# EAGLE design Connections and Power (EAGLE 8.5.2)
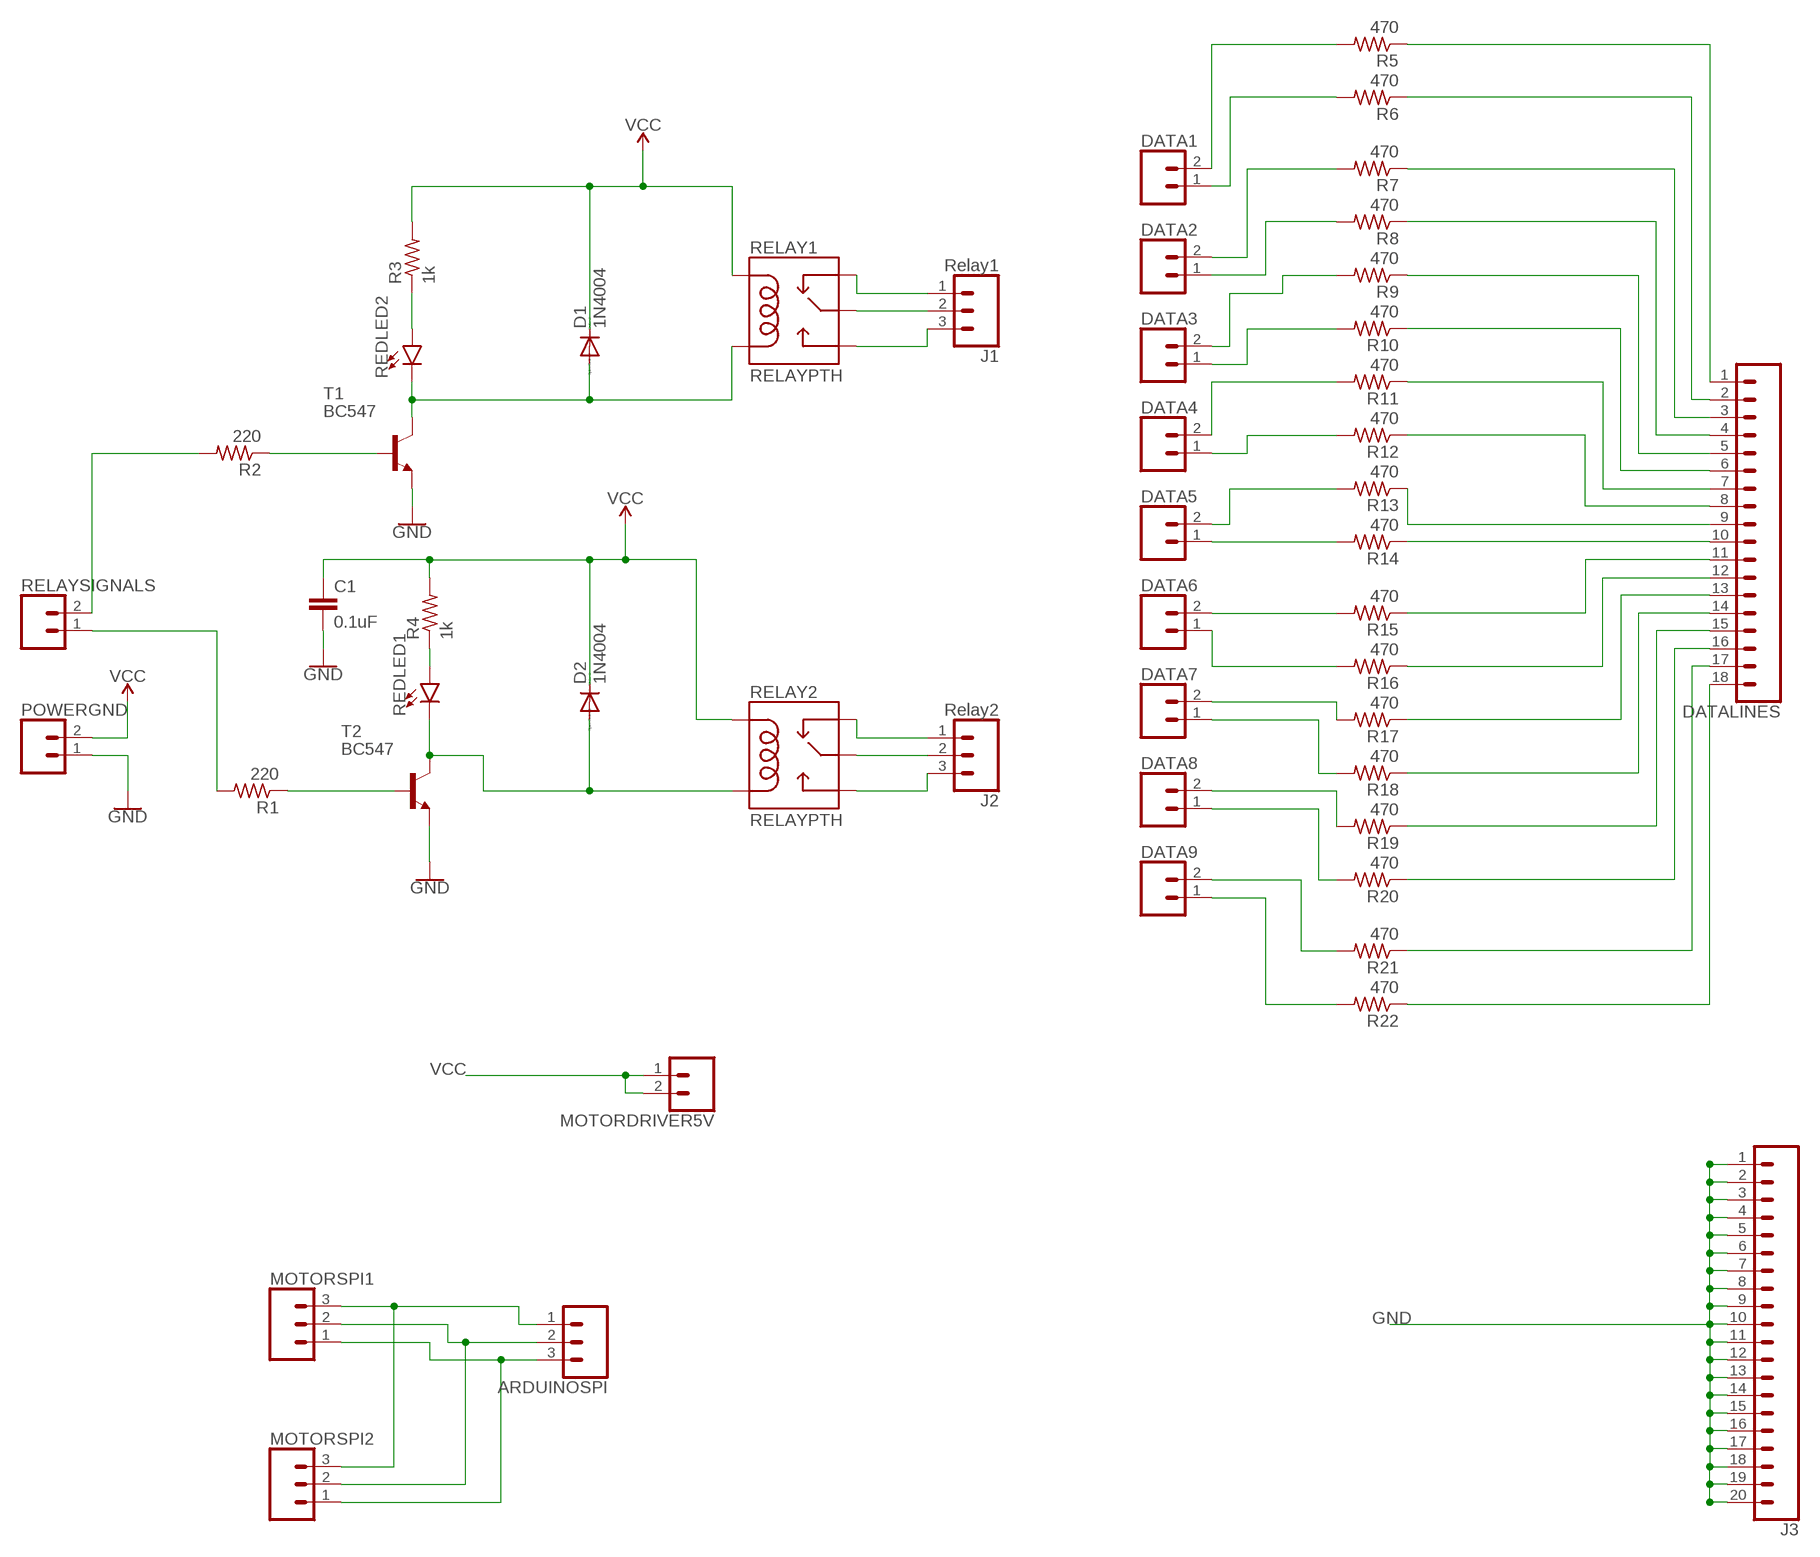
[diagram p0: schematic, sheet 1]

## Parts
ARDUINOSPI  CONN_03  [1X03]
C1  0.1uF  0.1UF-KIT-EZ-50V-20%  [CAP-PTH-SMALL-KIT]
D1  1N4004  [DO41-10]
D2  1N4004  [DO41-10]
DATA1  CONN_023.5MM  [SCREWTERMINAL-3.5MM-2]
DATA2  CONN_023.5MM  [SCREWTERMINAL-3.5MM-2]
DATA3  CONN_023.5MM  [SCREWTERMINAL-3.5MM-2]
DATA4  CONN_023.5MM  [SCREWTERMINAL-3.5MM-2]
DATA5  CONN_023.5MM  [SCREWTERMINAL-3.5MM-2]
DATA6  CONN_023.5MM  [SCREWTERMINAL-3.5MM-2]
DATA7  CONN_023.5MM  [SCREWTERMINAL-3.5MM-2]
DATA8  CONN_023.5MM  [SCREWTERMINAL-3.5MM-2]
DATA9  CONN_023.5MM  [SCREWTERMINAL-3.5MM-2]
DATALINES  CONN_18  [1X18]
J1  Relay1  CONN_03-SCREW-5MM  [SCREWTERMINAL-5MM-3]
J2  Relay2  CONN_03-SCREW-5MM  [SCREWTERMINAL-5MM-3]
J3  CONN_20  [1X20]
MOTORDRIVER5V  CONN_02  [1X02]
MOTORSPI1  CONN_03  [1X03]
MOTORSPI2  CONN_03  [1X03]
POWERGND  CONN_025MM  [SCREWTERMINAL-5MM-2]
R1  220  R-US_0309/12  [0309/12]
R2  220  R-US_0309/12  [0309/12]
R3  1k  R-US_0309/12  [0309/12]
R4  1k  R-US_0309/12  [0309/12]
R5  470  R-US_0309/12  [0309/12]
R6  470  R-US_0309/12  [0309/12]
R7  470  R-US_0309/12  [0309/12]
R8  470  R-US_0309/12  [0309/12]
R9  470  R-US_0309/12  [0309/12]
R10  470  R-US_0309/12  [0309/12]
R11  470  R-US_0309/12  [0309/12]
R12  470  R-US_0309/12  [0309/12]
R13  470  R-US_0309/12  [0309/12]
R14  470  R-US_0309/12  [0309/12]
R15  470  R-US_0309/12  [0309/12]
R16  470  R-US_0309/12  [0309/12]
R17  470  R-US_0309/12  [0309/12]
R18  470  R-US_0309/12  [0309/12]
R19  470  R-US_0309/12  [0309/12]
R20  470  R-US_0309/12  [0309/12]
R21  470  R-US_0309/12  [0309/12]
R22  470  R-US_0309/12  [0309/12]
REDLED1  LED1206  [LED-1206]
REDLED2  LED1206  [LED-1206]
RELAY1  RELAYPTH  [SRD-05VDC-SL-C]
RELAY2  RELAYPTH  [SRD-05VDC-SL-C]
RELAYSIGNALS  CONN_025MM  [SCREWTERMINAL-5MM-2]
T1  BC547  [TO92]
T2  BC547  [TO92]

## Nets
GND: C1.2 J3.1 J3.2 J3.3 J3.4 J3.5 J3.6 J3.7 J3.8 J3.9 J3.10 J3.11 J3.12 J3.13 J3.14 J3.15 J3.16 J3.17 J3.18 J3.19 J3.20 POWERGND.1 T1.1(E) T2.1(E)
N$1: DATA1.2 R5.2
N$2: D2.A REDLED1.C RELAY2.COIL0 T2.3(C)
N$3: R4.1 REDLED1.A
N$4: R2.2 RELAYSIGNALS.2
N$5: J2.1 RELAY2.SWCLOSED(SWCLOSE)
N$6: J2.2 RELAY2.SWCOMMON
N$7: J2.3 RELAY2.SWOPEN
N$8: R1.1 T2.2(B)
N$9: R2.1 T1.2(B)
N$10: D1.A REDLED2.C RELAY1.COIL0 T1.3(C)
N$11: R3.1 REDLED2.A
N$12: DATA1.1 R6.2
N$13: J1.1 RELAY1.SWCLOSED(SWCLOSE)
N$14: J1.2 RELAY1.SWCOMMON
N$15: J1.3 RELAY1.SWOPEN
N$16: R1.2 RELAYSIGNALS.1
N$17: DATA2.2 R7.2
N$18: DATA2.1 R8.2
N$19: DATA3.2 R9.2
N$20: DATA3.1 R10.2
N$21: DATA4.2 R11.2
N$22: DATA4.1 R12.2
N$23: DATA5.2 R13.2
N$24: DATA5.1 R14.2
N$25: DATA6.2 R15.2
N$26: DATA6.1 R16.2
N$27: DATA7.2 R17.2
N$28: DATA7.1 R18.2
N$29: DATA8.2 R19.2
N$30: DATA8.1 R20.2
N$31: DATA9.2 R21.2
N$32: DATA9.1 R22.2
N$33: DATALINES.18 R22.1
N$34: DATALINES.17 R21.1
N$35: DATALINES.16 R20.1
N$36: DATALINES.15 R19.1
N$37: DATALINES.14 R18.1
N$38: DATALINES.13 R17.1
N$39: DATALINES.12 R16.1
N$40: DATALINES.11 R15.1
N$41: DATALINES.10 R14.1
N$42: DATALINES.1 R5.1
N$43: DATALINES.2 R6.1
N$44: DATALINES.3 R7.1
N$45: DATALINES.4 R8.1
N$46: DATALINES.5 R9.1
N$47: DATALINES.6 R10.1
N$48: DATALINES.7 R11.1
N$49: DATALINES.8 R12.1
N$50: DATALINES.9 R13.1
N$52: ARDUINOSPI.1 MOTORSPI1.3 MOTORSPI2.3
N$54: ARDUINOSPI.2 MOTORSPI1.2 MOTORSPI2.2
N$55: ARDUINOSPI.3 MOTORSPI1.1 MOTORSPI2.1
VCC: C1.1 D1.C D2.C MOTORDRIVER5V.1 MOTORDRIVER5V.2 POWERGND.2 R3.2 R4.2 RELAY1.COIL1 RELAY2.COIL1

## Library data of the parts
ARDUINOSPI MOTORSPI1 MOTORSPI2 = SparkFun-Connectors:CONN_03: Multi connection point. Often used as Generic Header-pin footprint for 0.1 inch spaced/style header connections On any of the 0.1 inch spaced packages, you can populate with these: Break Away Headers - Straight <https://www.sparkfun.com/products/116> (PRT-00116) Break Away Male Headers - Right Angle <https://www.sparkfun.com/products/553> (PRT-00553) Female Headers <https://www.sparkfun.com/products/115> (PRT-00115) Break Away Headers - Machine Pin <https://www.sparkfun.com/products/117> (PRT-00117) Break Away Female Headers - Swiss Machine Pin <https://www.sparkfun.com/products/743> (PRT-00743) Stackable Header - 3 Pin (Female, 0.1") <https://www.sparkfun.com/products/13875> (PRT-13875) For SCREWTERMINALS and SPRING TERMINALS visit here: Screw Terimnals on SparkFun.com <https://www.sparkfun.com/search/results?term=Screw+Terminals> (5mm/3.5mm/2.54mm spacing) This device is also useful as a general connection point to wire up your design to another part of your project. Our various solder wires solder well into these plated through hole pads. Hook-Up Wire - Assortment (Stranded, 22 AWG) <https://www.sparkfun.com/products/11375> (PRT-11375) Hook-Up Wire - Assortment (Solid Core, 22 AWG) <https://www.sparkfun.com/products/11367> (PRT-11367) View the entire wire category on our website here <https://www.sparkfun.com/categories/141> Special notes: Molex polarized connector foot print use with SKU : PRT-08232 with associated crimp pins and housings.; PROD_ID: XXX-00000; VALUE: 455-1750-1-ND
C1 = SparkFun-Capacitors:0.1UF: 0.1µF ceramic capacitors A capacitor is a passive two-terminal electrical component used to store electrical energy temporarily in an electric field.; PROD_ID: CAP-08370
D1 D2 = diode:1N4004: DIODE general purpose rectifier, 1 A
DATA1-DATA9 = SparkFun-Connectors:CONN_02: Multi connection point. Often used as Generic Header-pin footprint for 0.1 inch spaced/style header connections On any of the 0.1 inch spaced packages, you can populate with these: Break Away Headers - Straight <https://www.sparkfun.com/products/116> (PRT-00116) Break Away Male Headers - Right Angle <https://www.sparkfun.com/products/553> (PRT-00553) Female Headers <https://www.sparkfun.com/products/115> (PRT-00115) Break Away Headers - Machine Pin <https://www.sparkfun.com/products/117> (PRT-00117) Break Away Female Headers - Swiss Machine Pin <https://www.sparkfun.com/products/743> (PRT-00743) For SCREWTERMINALS and SPRING TERMINALS visit here: Screw Terimnals on SparkFun.com <https://www.sparkfun.com/search/results?term=Screw+Terminals> (5mm/3.5mm/2.54mm spacing) This device is also useful as a general connection point to wire up your design to another part of your project. Our various solder wires solder well into these plated through hole pads. Hook-Up Wire - Assortment (Stranded, 22 AWG) <https://www.sparkfun.com/products/11375> (PRT-11375) Hook-Up Wire - Assortment (Solid Core, 22 AWG) <https://www.sparkfun.com/products/11367> (PRT-11367) View the entire wire category on our website here <https://www.sparkfun.com/categories/141> Special notes: Molex polarized connector foot print use with: PRT-08233 with associated crimp pins and housings. 2.54_SCREWTERM for use with PRT-10571. 3.5mm Screw Terminal footprints for PRT-08084 5mm Screw Terminal footprints for use with PRT-08432; PROD_ID: CONN-08399
DATALINES = SparkFun-Connectors:CONN_18: Multi connection point. Often used as Generic Header-pin footprint for 0.1 inch spaced/style header connections On any of the 0.1 inch spaced packages, you can populate with these: Break Away Headers - Straight <https://www.sparkfun.com/products/116> (PRT-00116) Break Away Male Headers - Right Angle <https://www.sparkfun.com/products/553> (PRT-00553) Female Headers <https://www.sparkfun.com/products/115> (PRT-00115) Break Away Headers - Machine Pin <https://www.sparkfun.com/products/117> (PRT-00117) Break Away Female Headers - Swiss Machine Pin <https://www.sparkfun.com/products/743> (PRT-00743) For SCREWTERMINALS and SPRING TERMINALS visit here: Screw Terimnals on SparkFun.com <https://www.sparkfun.com/search/results?term=Screw+Terminals> (5mm/3.5mm/2.54mm spacing) This device is also useful as a general connection point to wire up your design to another part of your project. Our various solder wires solder well into these plated through hole pads. Hook-Up Wire - Assortment (Stranded, 22 AWG) <https://www.sparkfun.com/products/11375> (PRT-11375) Hook-Up Wire - Assortment (Solid Core, 22 AWG) <https://www.sparkfun.com/products/11367> (PRT-11367) View the entire wire category on our website here <https://www.sparkfun.com/categories/141> Special notes: Molex polarized connector foot print use with SKU : PRT-08231 with associated crimp pins and housings. 1MM SMD Version SKU: PRT-10208 NOTES ON THE VARIANTS LOCK and LOCK_LONGPADS... This footprint was designed to help hold the alignment of a through-hole component (i.e. 6-pin header) while soldering it into place. You may notice that each hole has been shifted either up or down by 0.005 of an inch from it's more standard position (which is a perfectly straight line). This slight alteration caused the pins (the squares in the middle) to touch the edges of the holes. Because they are alternating, it causes a "brace" to hold the component in place. 0.005 has proven to be the perfect amount of "off-center" position when using our standard breakaway headers. Although looks a little odd when you look at the bare footprint, once you have a header in there, the alteration is very hard to notice. Also,if you push a header all the way into place, it is covered up entirely on the bottom side.
J1 J2 = SparkFun-Connectors:CONN_03: Multi connection point. Often used as Generic Header-pin footprint for 0.1 inch spaced/style header connections On any of the 0.1 inch spaced packages, you can populate with these: Break Away Headers - Straight <https://www.sparkfun.com/products/116> (PRT-00116) Break Away Male Headers - Right Angle <https://www.sparkfun.com/products/553> (PRT-00553) Female Headers <https://www.sparkfun.com/products/115> (PRT-00115) Break Away Headers - Machine Pin <https://www.sparkfun.com/products/117> (PRT-00117) Break Away Female Headers - Swiss Machine Pin <https://www.sparkfun.com/products/743> (PRT-00743) Stackable Header - 3 Pin (Female, 0.1") <https://www.sparkfun.com/products/13875> (PRT-13875) For SCREWTERMINALS and SPRING TERMINALS visit here: Screw Terimnals on SparkFun.com <https://www.sparkfun.com/search/results?term=Screw+Terminals> (5mm/3.5mm/2.54mm spacing) This device is also useful as a general connection point to wire up your design to another part of your project. Our various solder wires solder well into these plated through hole pads. Hook-Up Wire - Assortment (Stranded, 22 AWG) <https://www.sparkfun.com/products/11375> (PRT-11375) Hook-Up Wire - Assortment (Solid Core, 22 AWG) <https://www.sparkfun.com/products/11367> (PRT-11367) View the entire wire category on our website here <https://www.sparkfun.com/categories/141> Special notes: Molex polarized connector foot print use with SKU : PRT-08232 with associated crimp pins and housings.; PROD_ID: CONN-10134; SF_SKU: PRT-08433
J3 = SparkFun-Connectors:CONN_20: Multi connection point. Often used as Generic Header-pin footprint for 0.1 inch spaced/style header connections On any of the 0.1 inch spaced packages, you can populate with these: Break Away Headers - Straight <https://www.sparkfun.com/products/116> (PRT-00116) Break Away Male Headers - Right Angle <https://www.sparkfun.com/products/553> (PRT-00553) Female Headers <https://www.sparkfun.com/products/115> (PRT-00115) Break Away Headers - Machine Pin <https://www.sparkfun.com/products/117> (PRT-00117) Break Away Female Headers - Swiss Machine Pin <https://www.sparkfun.com/products/743> (PRT-00743) For SCREWTERMINALS and SPRING TERMINALS visit here: Screw Terimnals on SparkFun.com <https://www.sparkfun.com/search/results?term=Screw+Terminals> (5mm/3.5mm/2.54mm spacing) This device is also useful as a general connection point to wire up your design to another part of your project. Our various solder wires solder well into these plated through hole pads. Hook-Up Wire - Assortment (Stranded, 22 AWG) <https://www.sparkfun.com/products/11375> (PRT-11375) Hook-Up Wire - Assortment (Solid Core, 22 AWG) <https://www.sparkfun.com/products/11367> (PRT-11367) View the entire wire category on our website here <https://www.sparkfun.com/categories/141> Special notes: Molex polarized connector foot print use with SKU : PRT-08231 with associated crimp pins and housings. 1MM SMD Version SKU: PRT-10208 NOTES ON THE VARIANTS LOCK and LOCK_LONGPADS... This footprint was designed to help hold the alignment of a through-hole component (i.e. 6-pin header) while soldering it into place. You may notice that each hole has been shifted either up or down by 0.005 of an inch from it's more standard position (which is a perfectly straight line). This slight alteration caused the pins (the squares in the middle) to touch the edges of the holes. Because they are alternating, it causes a "brace" to hold the component in place. 0.005 has proven to be the perfect amount of "off-center" position when using our standard breakaway headers. Although looks a little odd when you look at the bare footprint, once you have a header in there, the alteration is very hard to notice. Also,if you push a header all the way into place, it is covered up entirely on the bottom side. Note about LOCK SPECIAL package: This is just like the LOCK variant in that the holes are staggared by 5 mil, but except for the last two holes. They are not altered from the "standard" footprint layout. This is used for a special purpose on the layout of our Graphic LCD Backpack. Make sure you want to use this device before selecting it for you project!
MOTORDRIVER5V = SparkFun-Connectors:CONN_02: Multi connection point. Often used as Generic Header-pin footprint for 0.1 inch spaced/style header connections On any of the 0.1 inch spaced packages, you can populate with these: Break Away Headers - Straight <https://www.sparkfun.com/products/116> (PRT-00116) Break Away Male Headers - Right Angle <https://www.sparkfun.com/products/553> (PRT-00553) Female Headers <https://www.sparkfun.com/products/115> (PRT-00115) Break Away Headers - Machine Pin <https://www.sparkfun.com/products/117> (PRT-00117) Break Away Female Headers - Swiss Machine Pin <https://www.sparkfun.com/products/743> (PRT-00743) For SCREWTERMINALS and SPRING TERMINALS visit here: Screw Terimnals on SparkFun.com <https://www.sparkfun.com/search/results?term=Screw+Terminals> (5mm/3.5mm/2.54mm spacing) This device is also useful as a general connection point to wire up your design to another part of your project. Our various solder wires solder well into these plated through hole pads. Hook-Up Wire - Assortment (Stranded, 22 AWG) <https://www.sparkfun.com/products/11375> (PRT-11375) Hook-Up Wire - Assortment (Solid Core, 22 AWG) <https://www.sparkfun.com/products/11367> (PRT-11367) View the entire wire category on our website here <https://www.sparkfun.com/categories/141> Special notes: Molex polarized connector foot print use with: PRT-08233 with associated crimp pins and housings. 2.54_SCREWTERM for use with PRT-10571. 3.5mm Screw Terminal footprints for PRT-08084 5mm Screw Terminal footprints for use with PRT-08432
POWERGND RELAYSIGNALS = SparkFun-Connectors:CONN_02: Multi connection point. Often used as Generic Header-pin footprint for 0.1 inch spaced/style header connections On any of the 0.1 inch spaced packages, you can populate with these: Break Away Headers - Straight <https://www.sparkfun.com/products/116> (PRT-00116) Break Away Male Headers - Right Angle <https://www.sparkfun.com/products/553> (PRT-00553) Female Headers <https://www.sparkfun.com/products/115> (PRT-00115) Break Away Headers - Machine Pin <https://www.sparkfun.com/products/117> (PRT-00117) Break Away Female Headers - Swiss Machine Pin <https://www.sparkfun.com/products/743> (PRT-00743) For SCREWTERMINALS and SPRING TERMINALS visit here: Screw Terimnals on SparkFun.com <https://www.sparkfun.com/search/results?term=Screw+Terminals> (5mm/3.5mm/2.54mm spacing) This device is also useful as a general connection point to wire up your design to another part of your project. Our various solder wires solder well into these plated through hole pads. Hook-Up Wire - Assortment (Stranded, 22 AWG) <https://www.sparkfun.com/products/11375> (PRT-11375) Hook-Up Wire - Assortment (Solid Core, 22 AWG) <https://www.sparkfun.com/products/11367> (PRT-11367) View the entire wire category on our website here <https://www.sparkfun.com/categories/141> Special notes: Molex polarized connector foot print use with: PRT-08233 with associated crimp pins and housings. 2.54_SCREWTERM for use with PRT-10571. 3.5mm Screw Terminal footprints for PRT-08084 5mm Screw Terminal footprints for use with PRT-08432; SF_SKU: PRT-08432
R1-R22 = resistor:R-US_: RESISTOR, American symbol
REDLED1 REDLED2 = SparkFun-LED:LED: LED (Generic) Standard schematic elements and footprints for 5mm, 3mm, 1206, and 0603 sized LEDs. Generic LEDs with no color specified.
RELAY1 RELAY2 = SRD-05VDC-SL-C:RELAY: SPDT relay (COM-00101)
T1 T2 = transistor:BC547: NPN TRANSISTOR

## Board
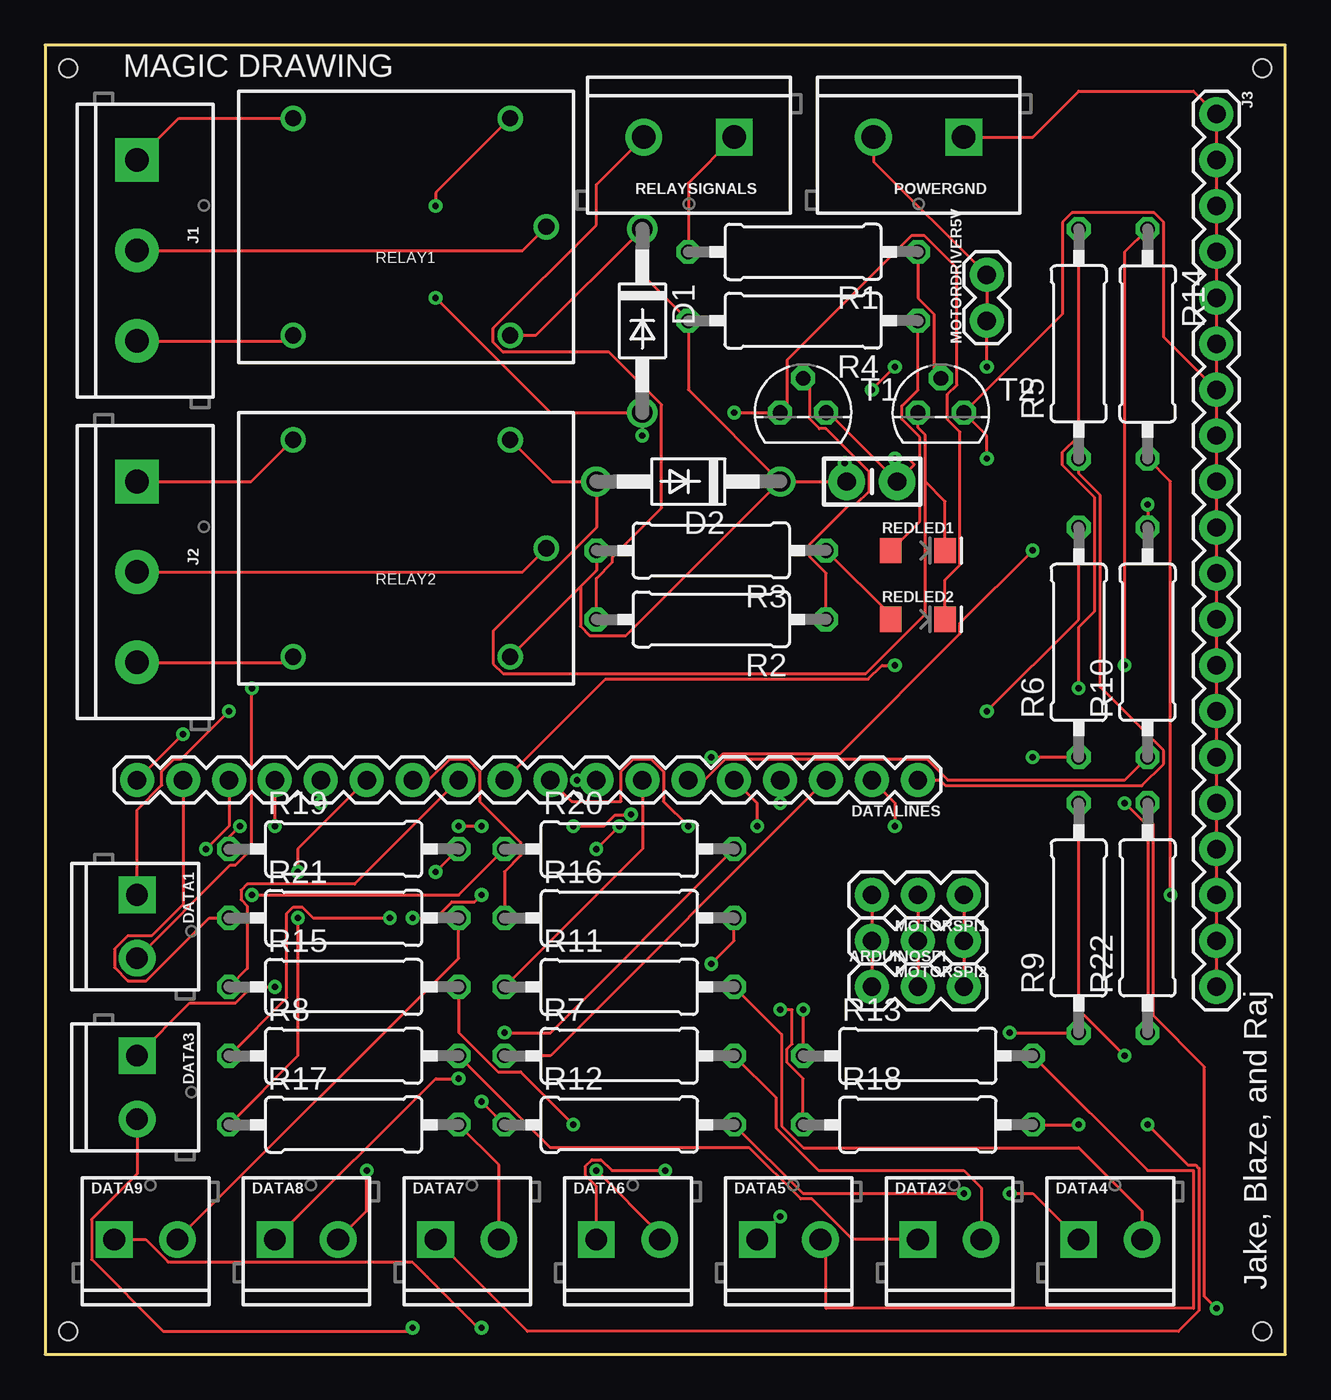
[diagram p1: board, top side]
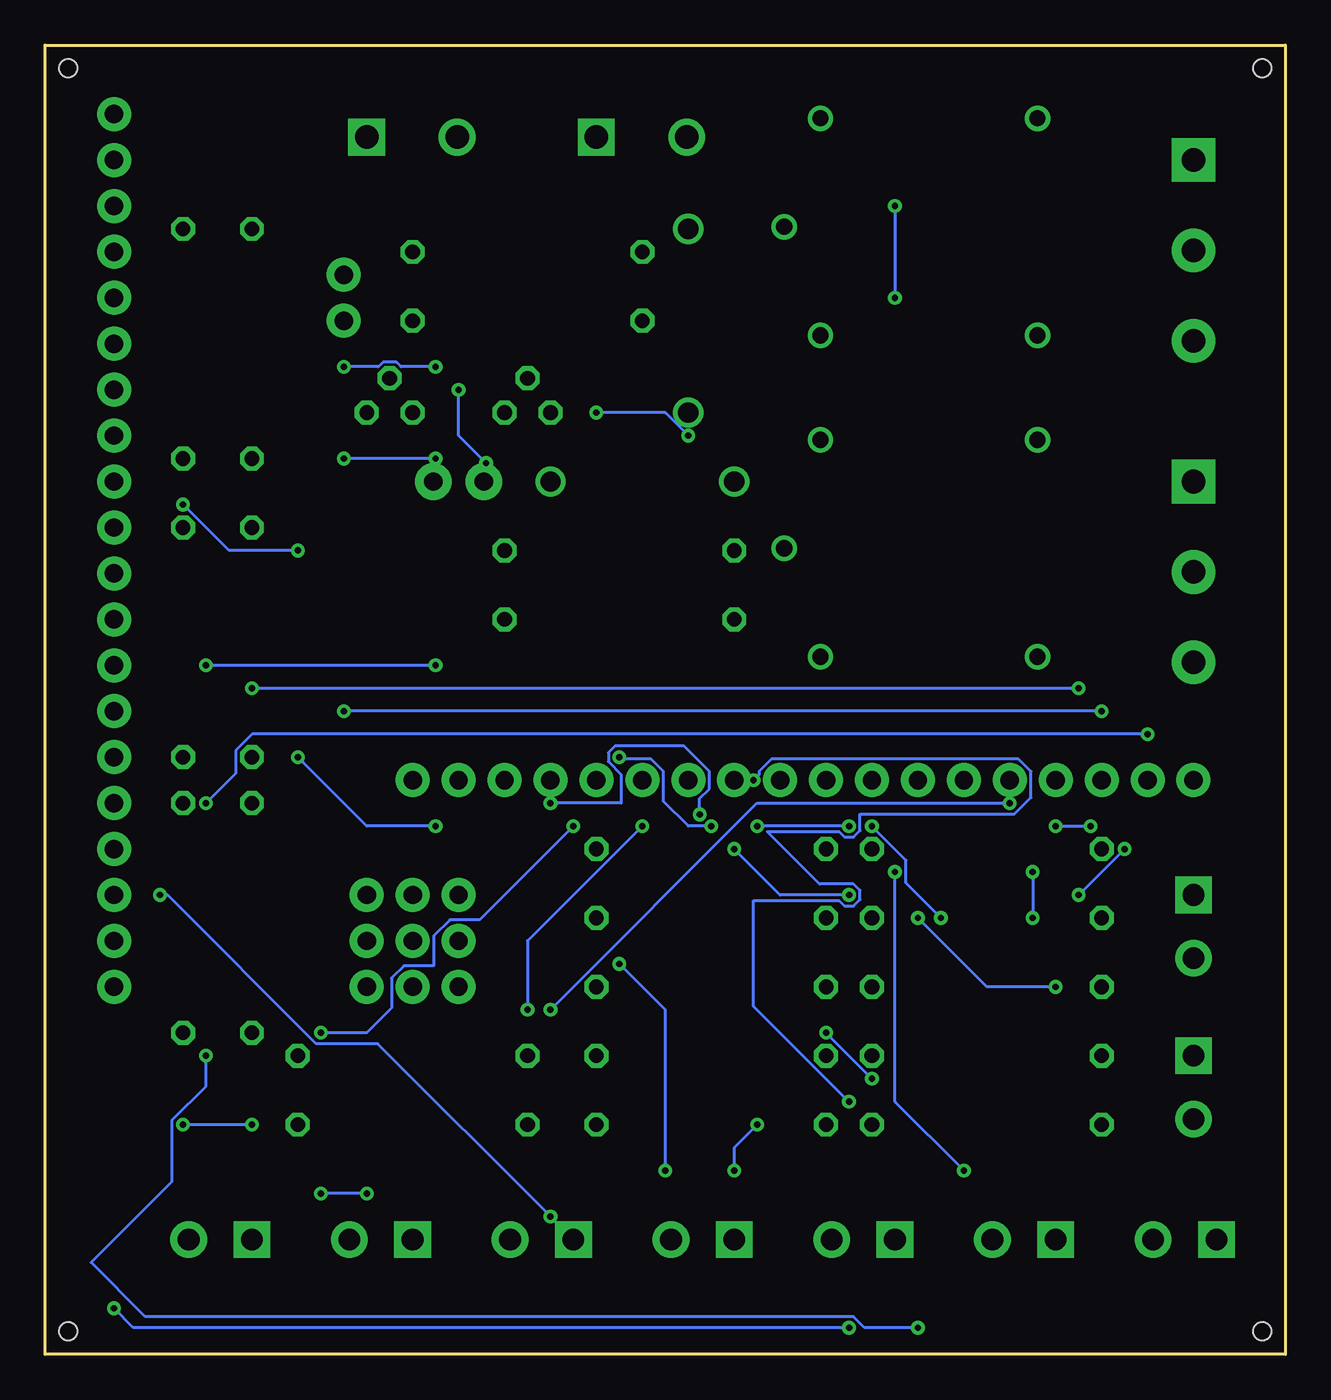
[diagram p2: board, bottom side, seen from below]

Size 68.58 x 72.39 mm. Coordinates in mm from the lower left corner, seen from the top.
Outline: 0,72.39 0,0 68.58,0 68.58,72.39 0,72.39
Copper layers (1*16): Top 0.035mm / dielectric 1.5mm / Bottom 0.035mm
Design rules "default": minimum track width 6mil, minimum drill 0.35mm, track to track 6mil, track to pad 6mil, pad to pad 6mil, via to via 6mil, smd to smd 6mil, copper to edge 40mil, drill to drill 6mil, minimum pad ring 10mil, minimum via ring 8mil, stop-mask expansion 4mil, vias tented up to drill 0mil, thermal gap 10mil
Holes 1 mm at 1.27,71.12 67.31,71.12 1.27,1.27 67.31,1.27

### Footprints (pad centres in the part's own frame; a part is rotated, then mirrored left to right if it is on the bottom)
1X03 = drill 1.016 pad 1.88: 1 0,0; 2 2.54,0; 3 5.08,0
CAP-PTH-SMALL-KIT = drill 1.016 pad 2.032: 1 -1.397,0; 2 1.397,0
DO41-10 = drill 1.118: A 5.08,0; C -5.08,0
SCREWTERMINAL-3.5MM-2 = drill 1.2 pad 2.032 square: 1 0,0 | drill 1.2 pad 2.032: 2 3.5,0
1X18 = drill 1.016 pad 1.88: 1 0,0; 2 2.54,0; 3 5.08,0; 4 7.62,0; 5 10.16,0; 6 12.7,0; 7 15.24,0; 8 17.78,0; 9 20.32,0; 10 22.86,0; 11 25.4,0; 12 27.94,0; 13 30.48,0; 14 33.02,0; 15 35.56,0; 16 38.1,0; 17 40.64,0; 18 43.18,0
SCREWTERMINAL-5MM-3 = drill 1.3 pad 2.413 square: 1 0,0 | drill 1.3 pad 2.413: 2 5,0; 3 10,0
1X20 = drill 1.016 pad 1.88: 1 0,0; 2 2.54,0; 3 5.08,0; 4 7.62,0; 5 10.16,0; 6 12.7,0; 7 15.24,0; 8 17.78,0; 9 20.32,0; 10 22.86,0; 11 25.4,0; 12 27.94,0; 13 30.48,0; 14 33.02,0; 15 35.56,0; 16 38.1,0; 17 40.64,0; 18 43.18,0; 19 45.72,0; 20 48.26,0
1X02 = drill 1.016 pad 1.88: 1 0,0; 2 2.54,0
SCREWTERMINAL-5MM-2 = drill 1.3 pad 2.032 square: 1 0,0 | drill 1.3 pad 2.032: 2 5,0
0309/12 = drill 0.813 octagon: 1 -6.35,0; 2 6.35,0
LED-1206 = smd 1.2 x 1.4: A -1.5,0; C 1.5,0
SRD-05VDC-SL-C = drill 0.9: COIL0 -5.39,-6.12; COIL1 -5.39,5.88; SWCLOSED 6.61,-6.12; SWCOMMON -7.39,-0.12; SWOPEN 6.61,5.88
TO92 = drill 0.813 octagon: 1 1.27,0; 2 0,1.905; 3 -1.27,0

### Placement (x,y rotation side)
ARDUINOSPI  45.72,20.32 0 top
C1  45.72,48.26 0 top
D1  33.02,57.15 270 top
D2  35.56,48.26 180 top
DATA1  5.08,25.4 270 top
DATA2  48.26,6.35 0 top
DATA3  5.08,16.51 270 top
DATA4  57.15,6.35 0 top
DATA5  39.37,6.35 0 top
DATA6  30.48,6.35 0 top
DATA7  21.59,6.35 0 top
DATA8  12.7,6.35 0 top
DATA9  3.81,6.35 0 top
DATALINES  48.26,31.75 180 top
J1  5.08,66.04 270 top
J2  5.08,48.26 270 top
J3  64.77,68.58 270 top
MOTORDRIVER5V  52.07,57.15 90 top
MOTORSPI1  50.8,25.4 180 top
MOTORSPI2  50.8,22.86 180 top
POWERGND  50.8,67.31 180 top
R1  41.91,60.96 180 top
R2  36.83,40.64 180 top
R3  36.83,44.45 180 top
R4  41.91,57.15 180 top
R5  57.15,55.88 90 top
R6  57.15,39.37 90 top
R7  31.75,16.51 0 top
R8  16.51,16.51 0 top
R9  57.15,24.13 90 top
R10  60.96,39.37 90 top
R11  31.75,20.32 0 top
R12  31.75,12.7 0 top
R13  48.26,16.51 0 top
R14  60.96,55.88 270 top
R15  16.51,20.32 0 top
R16  31.75,24.13 0 top
R17  16.51,12.7 0 top
R18  48.26,12.7 0 top
R19  16.51,27.94 0 top
R20  31.75,27.94 0 top
R21  16.51,24.13 0 top
R22  60.96,24.13 90 top
REDLED1  48.26,44.45 0 top
REDLED2  48.26,40.64 0 top
RELAY1  20.32,62.23 180 top
RELAY2  20.32,44.45 180 top
RELAYSIGNALS  38.1,67.31 180 top
T1  41.91,52.07 0 top
T2  49.53,52.07 0 top

### Tracks (layer width: path | path; a pad name or v marks a point on that pad's centre or on a via)
GND  (via drill 0.35)
  Top 0.152: POWERGND.1 54.61,67.31 57.15,69.85 63.5,69.85 J3.1 J3.2 J3.3 J3.4 J3.5 J3.6 J3.7 | J3.7 61.85,56.26 61.85,62.6 61.33,63.12 56.78,63.12 56.26,62.6 56.26,57.53 T2.1 52.07,50.8 v52.07,49.53 | v46.99,49.53 47.73,49.53 48.06,49.2 C1.2 43.31,52.07 T1.1 | J3.7 J3.8 J3.9 J3.10 J3.11 J3.12 J3.13 J3.14 J3.15 J3.16 J3.17 J3.18 J3.19 J3.20
  Bottom 0.152: v46.99,49.53 v52.07,49.53
N$1  (via drill 0.35)
  Top 0.152: DATA1.2 10.23,27.05 10.53,27.05 11.43,27.95 v11.43,36.83 | v57.15,36.83 57.15,40.21 58.04,41.1 58.04,47.38 56.26,49.16 56.26,49.9 57.15,50.79 R5.2
  Bottom 0.152: v11.43,36.83 v57.15,36.83
N$2
  Top 0.152: RELAY2.COIL0 28.02,48.26 D2.A 30.48,45.71 24.78,40.01 24.78,38.18 25.32,37.64 45.38,37.64 48.67,40.92 48.67,48.26 | T2.3 48.26,51.24 48.67,50.84 48.67,48.26 | REDLED1.C 49.76,47.17 48.67,48.26
N$3
  Top 0.152: R4.1 48.26,53.33 47.37,52.44 47.37,51.7 48.36,50.71 48.36,46.05 REDLED1.A
N$4
  Top 0.152: R2.2 30.48,42.91 31.37,43.8 31.37,44.08 34.09,46.8 34.09,52.51 31.18,55.42 25.32,55.42 24.78,55.96 24.78,56.74 30.48,62.44 30.48,64.69 RELAYSIGNALS.2
N$5
  Top 0.152: J2.1 11.4,48.26 RELAY2.SWCLOSED
N$6
  Top 0.152: J2.2 26.4,43.26 RELAY2.SWCOMMON
N$7
  Top 0.152: J2.3 13.4,38.26 RELAY2.SWOPEN
N$8
  Top 0.152: R1.1 48.26,58.41 49.15,57.52 49.15,54.36 T2.2
N$9
  Top 0.152: R2.1 43.18,43.19 42.29,44.08 42.29,44.82 44.49,47.01 44.84,47.01 45.57,47.74 45.57,48.78 43.16,51.18 42.81,51.18 42.29,51.7 42.29,53.59 T1.2
N$10  (via drill 0.35)
  Top 0.152: RELAY1.COIL0 21.59,64.23 v21.59,63.5 | v21.59,58.42 27.94,52.07 D1.A v33.02,50.8 | REDLED2.C 49.76,42.83 50.59,43.65 50.59,51 49.9,51.69 49.9,53.09 50.42,53.61 50.42,60.06 48.63,61.85 47.89,61.85 41.02,54.98 41.02,52.45 T1.3 v38.1,52.07
  Bottom 0.152: v21.59,63.5 v21.59,58.42 | v33.02,50.8 34.29,52.07 v38.1,52.07
N$11
  Top 0.152: R3.1 46.76,40.87 REDLED2.A
N$12  (via drill 0.35)
  Top 0.152: v10.16,35.56 7.52,32.92 7.14,32.92 6.45,32.23 6.45,31.47 5.08,30.1 DATA1.1 | v52.07,35.56 57.15,40.64 R6.2
  Bottom 0.152: v10.16,35.56 v52.07,35.56
N$13
  Top 0.152: J1.1 7.39,68.35 RELAY1.SWCLOSED
N$14
  Top 0.152: J1.2 26.4,61.04 RELAY1.SWCOMMON
N$15
  Top 0.152: J1.3 13.4,56.04 RELAY1.SWOPEN
N$16
  Top 0.152: RELAYSIGNALS.1 35.56,64.77 R1.2
N$17
  Top 0.152: R7.2 40.41,14.2 40.41,12.51 42.76,10.16 50.8,10.16 51.76,9.2 DATA2.2
N$18
  Top 0.152: DATA2.1 44.63,6.35 42.4,8.59 41.78,8.59 38.94,11.43 27.94,11.43 R8.2
N$19  (via drill 0.35)
  Top 0.152: DATA3.2 5.08,9.98 2.56,7.46 2.56,5.24 6.54,1.27 20.32,1.27 v20.32,1.47 | v59.69,16.51 57.15,19.05 R9.2
  Bottom 0.152: v20.32,1.47 23.27,1.47 23.88,2.08 63.04,2.08 66.04,5.08 61.57,9.55 61.57,12.95 59.69,14.83 v59.69,16.51
N$20  (via drill 0.35)
  Top 0.152: v12.7,20.32 11.42,20.32 10.53,19.43 8,19.43 DATA3.1 | v20.32,24.13 21.6,24.13 22.49,25.02 23.75,25.02 v24.13,25.4 | v30.48,27.94 v31.75,29.21 | v36.83,33.02 37.29,33.02 37.49,33.22 43.97,33.22 50.59,39.85 50.59,40.43 v54.61,44.45 | v60.96,46.99 R10.2
  Bottom 0.152: v12.7,20.32 16.51,20.32 v20.32,24.13 | v24.13,25.4 27.94,25.4 v30.48,27.94 | v31.75,29.21 33.02,29.21 34.39,30.58 34.39,32.23 35.08,32.92 36.73,32.92 v36.83,33.02 | v54.61,44.45 58.42,44.45 v60.96,46.99
N$21
  Top 0.152: R11.2 40.72,17.7 40.72,12.64 41.92,11.43 57.15,11.43 60.65,7.93 DATA4.2
N$22  (via drill 0.35)
  Top 0.152: R12.2 41.91,8.89 v50.8,8.89 | v53.34,8.89 54.61,8.89 DATA4.1
  Bottom 0.152: v50.8,8.89 v53.34,8.89
N$23
  Top 0.152: R13.2 60.96,10.16 63.5,10.16 63.5,2.54 43.18,2.54 43.18,6.04 DATA5.2
N$24  (via drill 0.35)
  Top 0.152: DATA5.1 v40.64,7.62 | v62.23,25.4 62.23,48.26 R14.2
  Bottom 0.152: v40.64,7.62 50.19,17.17 53.59,17.17 61.82,25.4 v62.23,25.4
N$25  (via drill 0.35)
  Top 0.152: v29.21,12.7 26.29,15.62 25.03,15.62 22.86,17.79 R15.2 | v30.48,10.16 33.98,6.66 DATA6.2
  Bottom 0.152: v29.21,12.7 30.48,11.43 v30.48,10.16
N$26  (via drill 0.35)
  Top 0.152: DATA6.1 30.48,9.3 29.87,9.91 29.87,10.41 30.23,10.77 30.73,10.77 31.34,10.16 v34.29,10.16 | v36.83,21.59 38.1,22.86 R16.2
  Bottom 0.152: v34.29,10.16 34.29,19.05 v36.83,21.59
N$27
  Top 0.152: DATA7.2 25.09,10.47 R17.2
N$28  (via drill 0.35)
  Top 0.152: R18.2 v57.15,12.7 | v60.96,12.7 63.2,10.46 63.63,10.46 63.8,10.29 63.8,2.41 62.66,1.27 26.67,1.27 DATA7.1
  Bottom 0.152: v57.15,12.7 v60.96,12.7
N$29  (via drill 0.35)
  Top 0.152: DATA8.2 17.78,7.93 v17.78,10.16 | v21.59,26.67 R19.2
  Bottom 0.152: v17.78,10.16 21.59,13.97 v21.59,26.67
N$30  (via drill 0.35)
  Top 0.152: DATA8.1 21.59,15.24 v22.86,15.24 | v25.4,17.78 27.94,17.78 R20.2
  Bottom 0.152: v22.86,15.24 v25.4,17.78
N$31
  Top 0.152: DATA9.2 22.86,21.9 R21.2
N$32  (via drill 0.35)
  Top 0.152: DATA9.1 5.55,6.35 6.79,5.1 20.29,5.1 24.13,1.27 v24.13,1.47 | v64.77,2.54 64.11,3.2 64.11,15.89 61.27,18.73 61.27,29.34 60.96,29.64 R22.2
  Bottom 0.152: v24.13,1.47 63.7,1.47 v64.77,2.54
N$33  (via drill 0.35)
  Top 0.152: DATALINES.18 v7.62,34.29 | v59.69,30.48 60.96,29.21 R22.1
  Bottom 0.152: v59.69,30.48 58.04,32.13 58.04,33.39 57.14,34.29 v7.62,34.29
N$34
  Top 0.152: 7.62,30.48 DATALINES.17 7.62,24.87 5.89,23.14 4.56,23.14 3.83,22.42 3.83,21.38 4.56,20.66 5.6,20.66 9.07,24.13 R21.1
N$35  (via drill 0.35)
  Top 0.152: DATALINES.16 10.16,29.21 v8.89,27.94 | v11.43,25.4 22.86,25.4 R20.1
  Bottom 0.152: v8.89,27.94 v11.43,25.4
N$36  (via drill 0.35)
  Top 0.152: DATALINES.15 v12.7,29.21 | v10.77,29.21 10.16,28.6 R19.1
  Bottom 0.152: v12.7,29.21 v10.77,29.21
N$37  (via drill 0.35)
  Top 0.152: R18.1 41.91,15.25 41.02,16.14 41.02,16.88 41.3,17.16 41.3,19.05 v40.64,19.05 | v15.24,30.48 DATALINES.14
  Bottom 0.152: v40.64,19.05 29.21,30.48 v15.24,30.48
N$38  (via drill 0.35)
  Top 0.152: DATALINES.13 13.97,27.94 v13.97,26.67 | v13.97,24.13 13.97,16.51 R17.1
  Bottom 0.152: v13.97,26.67 v13.97,24.13
N$39
  Top 0.152: R16.1 25.4,26.68 26.29,27.57 26.29,28.31 24.03,30.57 24.03,32.23 23.34,32.92 22.38,32.92 21.21,31.75 DATALINES.12
N$40
  Top 0.152: DATALINES.11 17.12,26.01 11.18,26.01 10.82,25.65 10.82,25.15 11.18,24.79 11.18,21.34 R15.1
N$41  (via drill 0.35)
  Top 0.152: DATALINES.10 30.98,37.33 45.51,37.33 46.27,38.1 v46.99,38.1 | v59.69,38.1 59.69,60.96 R14.1
  Bottom 0.152: v46.99,38.1 v59.69,38.1
N$42
  Top 0.152: R5.1 57.15,48.7 58.34,47.51 58.34,36.89 61.85,33.39 61.85,32.65 60.64,31.45 49.79,31.45 49.48,31.75 DATALINES.1
N$43  (via drill 0.35)
  Top 0.152: DATALINES.2 46.99,30.48 v46.99,29.21 | v54.61,33.02 R6.1
  Bottom 0.152: v46.99,29.21 50.8,29.21 v54.61,33.02
N$44
  Top 0.152: DATALINES.3 27.94,16.51 R7.1
N$45  (via drill 0.35)
  Top 0.152: R8.1 13.36,19.71 13.36,24.38 13.72,24.74 14.22,24.74 14.83,24.13 v19.05,24.13 | v22.86,29.21 v24.13,29.21 | v29.21,29.21 30.89,29.21 31.5,29.82 32.36,29.82 v32.39,29.85 | v40.64,30.48 DATALINES.4
  Bottom 0.152: v19.05,24.13 20.98,26.06 20.98,27.32 22.86,29.2 v22.86,29.21 | v24.13,29.21 v29.21,29.21 | v40.64,30.48 36.73,30.48 36.73,32.06 37.44,32.77 37.44,33.27 37.08,33.63 33.24,33.63 31.85,32.23 31.85,31.27 32.39,30.73 v32.39,29.85
N$46  (via drill 0.35)
  Top 0.152: DATALINES.5 39.37,30.48 v39.37,29.21 | v53.34,17.78 R9.1
  Bottom 0.152: v53.34,17.78 50.8,17.78 49.43,19.15 49.43,20.8 48.74,21.49 47.09,21.49 47.09,23.14 46.2,24.03 44.55,24.03 v39.37,29.21
N$47
  Top 0.152: R10.1 59.69,31.75 49.91,31.75 48.74,32.92 37.62,32.92 36.45,31.75 DATALINES.6
N$48
  Top 0.152: DATALINES.7 33.02,27.94 R11.1
N$49  (via drill 0.35)
  Top 0.152: R12.1 v24.13,13.97 | v29.41,31.75 DATALINES.8
  Bottom 0.152: v24.13,13.97 29.41,19.25 29.41,25.09 24.68,25.09 24.38,24.79 23.88,24.79 23.52,25.15 23.52,25.65 23.88,26.01 25.76,26.01 28.66,28.91 24.68,28.91 24.38,28.6 23.88,28.6 23.52,28.96 23.52,29.87 14.99,29.87 14.07,30.79 14.07,32.23 14.76,32.92 28.42,32.92 29.11,32.23 29.11,32.05 v29.41,31.75
N$50  (via drill 0.35)
  Top 0.152: DATALINES.9 29.11,30.58 31.85,30.58 31.85,32.23 32.54,32.92 33.5,32.92 34.19,32.23 34.19,30.58 v35.56,29.21 | v41.91,19.05 R13.1
  Bottom 0.152: v35.56,29.21 41.91,22.86 v41.91,19.05
N$52
  Top 0.152: MOTORSPI1.3 MOTORSPI2.3 ARDUINOSPI.1
N$54
  Top 0.152: MOTORSPI1.2 MOTORSPI2.2 ARDUINOSPI.2
N$55
  Top 0.152: MOTORSPI1.1 MOTORSPI2.1 ARDUINOSPI.3
VCC  (via drill 0.35)
  Top 0.152: RELAY1.COIL1 27.14,56.35 D1.C 33.02,59.69 R4.2 35.56,53.34 D2.C | D2.C C1.1 44.32,49.16 v44.2,49.28 | POWERGND.2 45.8,65.96 MOTORDRIVER5V.2 MOTORDRIVER5V.1 v52.07,54.61 | 29.59,42.45 RELAY2.COIL1 | R3.2 30.48,43.34 29.59,42.45 | 29.59,42.45 29.59,40.27 30.11,39.75 32.13,39.75 D2.C | v45.72,53.34 v46.99,54.61
  Bottom 0.152: v44.2,49.28 45.72,50.8 v45.72,53.34 | v46.99,54.61 48.91,54.61 49.16,54.86 49.9,54.86 50.15,54.61 v52.07,54.61

### Text on the board
tPlace: MAGIC DRAWING | Jake, Blaze, and Raj